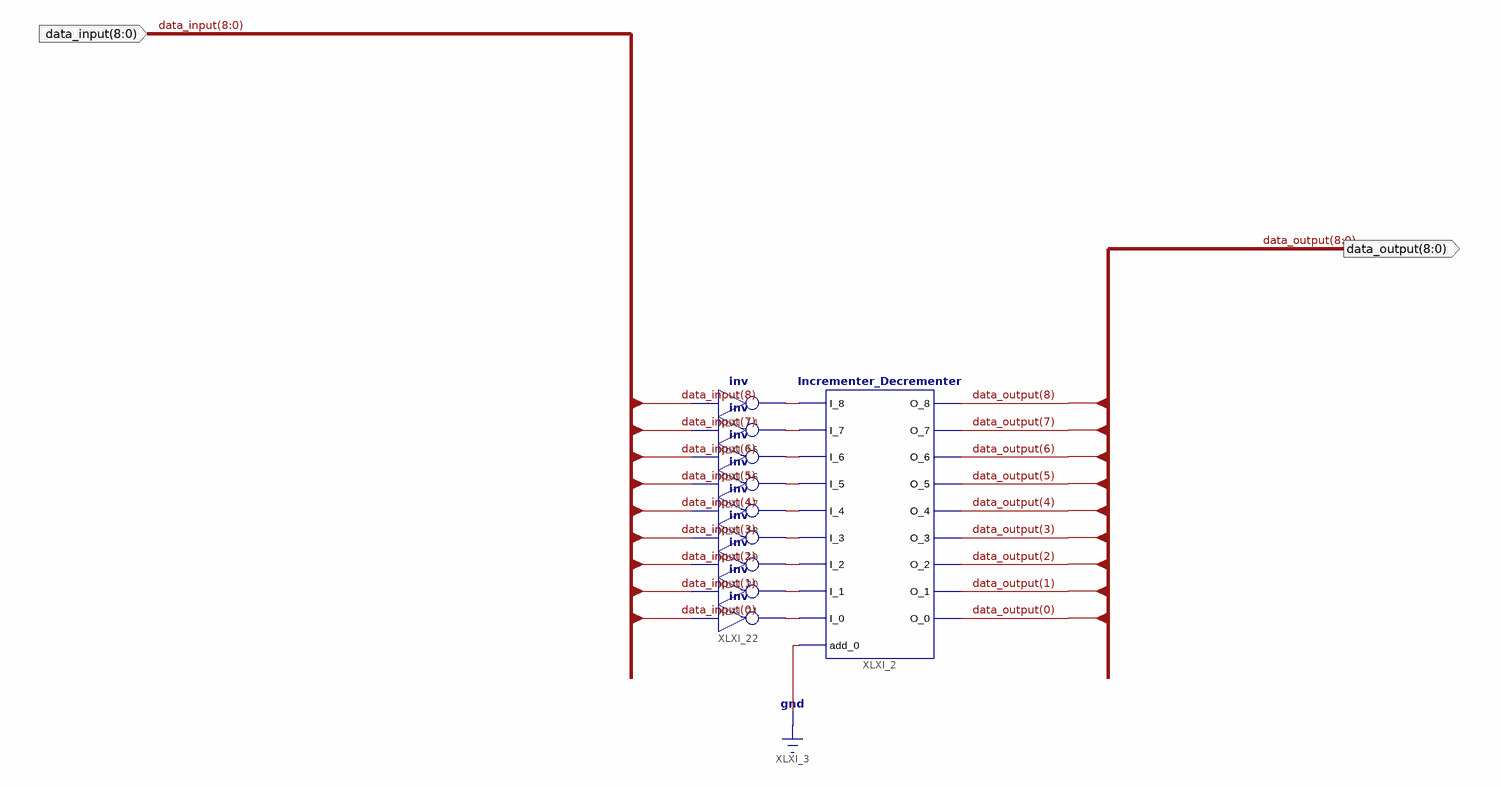
[diagram p0: schematic sheet 1]
// Xilinx ISE schematic twos_compliment_using_inverter.sch (spartan3e) as structural Verilog: 10 symbols, 2 ports
module twos_compliment_using_inverter (
  input  [8:0] data_input,
  output [8:0] data_output
);

  wire XLXN_53, XLXN_54, XLXN_55, XLXN_56, XLXN_57, XLXN_58, XLXN_59, XLXN_60, XLXN_61;

  Incrementer_Decrementer XLXI_2 (
    .add_0(1'b0), .I_7(XLXN_54), .I_6(XLXN_55), .I_5(XLXN_56), .I_4(XLXN_57), .I_3(XLXN_58), .I_2(XLXN_59),
    .I_1(XLXN_60), .I_0(XLXN_61), .I_8(XLXN_53), .O_7(data_output[7]), .O_6(data_output[6]),
    .O_5(data_output[5]), .O_4(data_output[4]), .O_3(data_output[3]), .O_2(data_output[2]),
    .O_1(data_output[1]), .O_0(data_output[0]), .O_8(data_output[8]));
  not XLXI_14 (XLXN_53, data_input[8]);
  not XLXI_15 (XLXN_54, data_input[7]);
  not XLXI_16 (XLXN_55, data_input[6]);
  not XLXI_17 (XLXN_56, data_input[5]);
  not XLXI_18 (XLXN_57, data_input[4]);
  not XLXI_19 (XLXN_58, data_input[3]);
  not XLXI_20 (XLXN_59, data_input[2]);
  not XLXI_21 (XLXN_60, data_input[1]);
  not XLXI_22 (XLXN_61, data_input[0]);
endmodule
